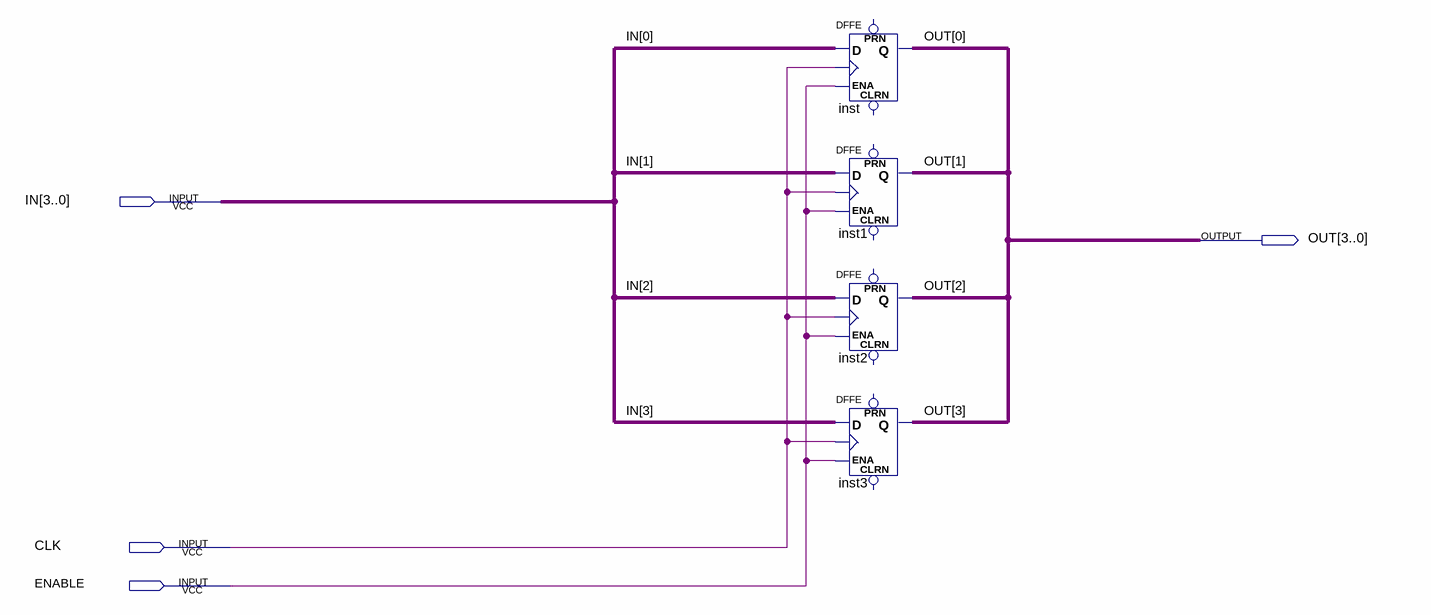
[diagram p0: schematic sheet]
// Quartus schematic Block1.bdf as structural Verilog: 4 symbols, 4 pins
module Block1 (
  input  [3:0] IN,
  input  CLK,
  input  ENABLE,
  output [3:0] OUT
);

  DFFE inst (.D(IN[0]), .CLK(CLK), .ENA(ENABLE), .Q(OUT[0]));  // open: PRN, CLRN
  DFFE inst1 (.D(IN[1]), .CLK(CLK), .ENA(ENABLE), .Q(OUT[1]));  // open: PRN, CLRN
  DFFE inst2 (.D(IN[2]), .CLK(CLK), .ENA(ENABLE), .Q(OUT[2]));  // open: PRN, CLRN
  DFFE inst3 (.D(IN[3]), .CLK(CLK), .ENA(ENABLE), .Q(OUT[3]));  // open: PRN, CLRN
endmodule
